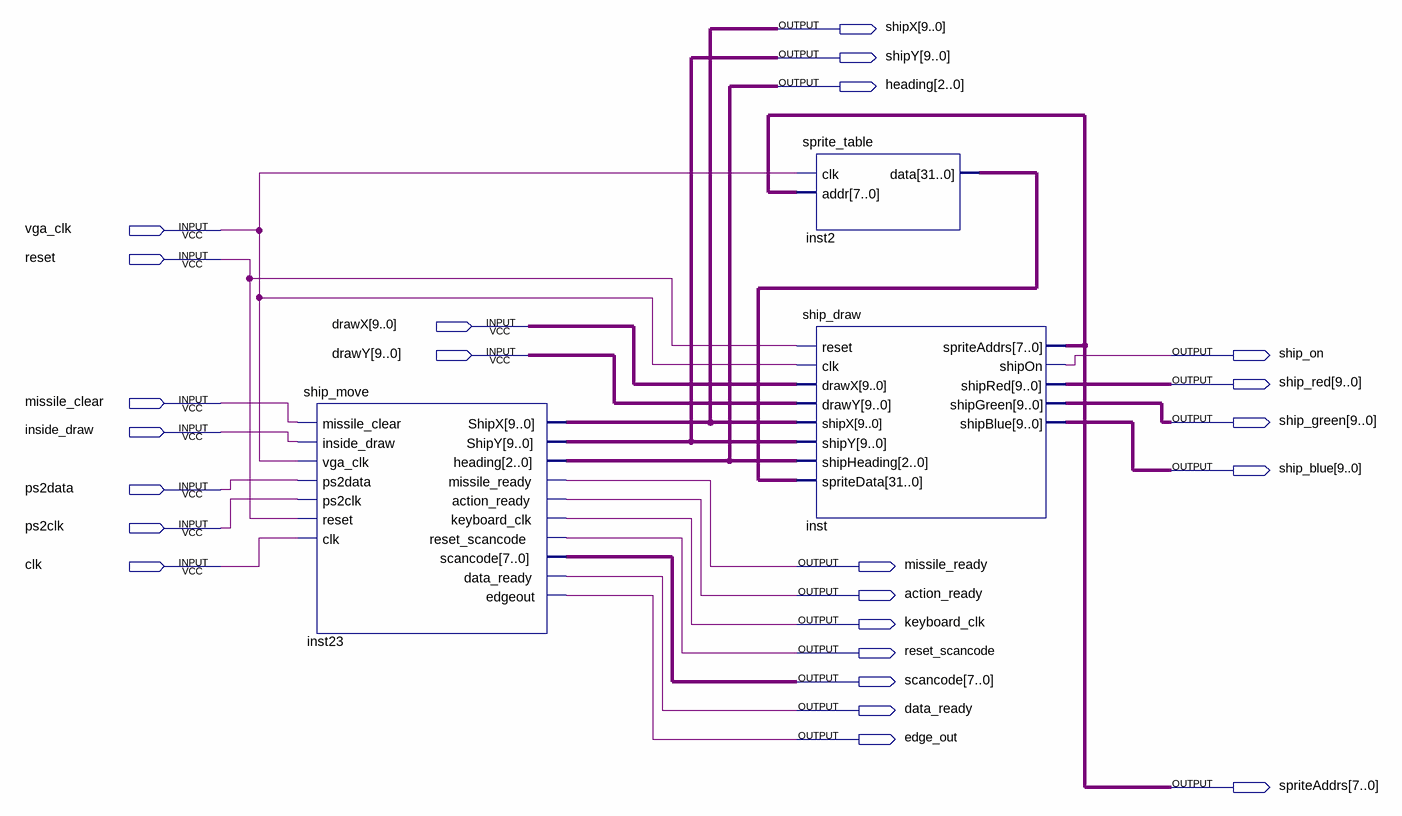
[diagram p0: schematic sheet]
// Quartus schematic ship.bdf as structural Verilog: 3 symbols, 24 pins
module ship (
  input  vga_clk,
  input  reset,
  input  [9:0] drawX,
  input  [9:0] drawY,
  input  missile_clear,
  input  inside_draw,
  input  ps2data,
  input  ps2clk,
  input  clk,
  output [9:0] shipX,
  output [9:0] shipY,
  output [2:0] heading,
  output ship_on,
  output [9:0] ship_red,
  output [9:0] ship_green,
  output [9:0] ship_blue,
  output missile_ready,
  output action_ready,
  output keyboard_clk,
  output reset_scancode,
  output [7:0] scancode,
  output data_ready,
  output edge_out,
  output [7:0] spriteAddrs
);

  wire [31:0] inst2_data;

  ship_move inst23 (
    .missile_clear(missile_clear), .inside_draw(inside_draw), .vga_clk(vga_clk), .ps2data(ps2data),
    .ps2clk(ps2clk), .reset(reset), .clk(clk), .ShipX(shipX), .ShipY(shipY), .heading(heading),
    .missile_ready(missile_ready), .action_ready(action_ready), .keyboard_clk(keyboard_clk),
    .reset_scancode(reset_scancode), .scancode(scancode), .data_ready(data_ready), .edgeout(edge_out));
  sprite_table inst2 (.clk(vga_clk), .addr(spriteAddrs), .data(inst2_data));
  ship_draw inst (
    .reset(reset), .clk(vga_clk), .drawX(drawX), .drawY(drawY), .shipX(shipX), .shipY(shipY),
    .shipHeading(heading), .spriteData(inst2_data), .spriteAddrs(spriteAddrs), .shipOn(ship_on),
    .shipRed(ship_red), .shipGreen(ship_green), .shipBlue(ship_blue));
endmodule
